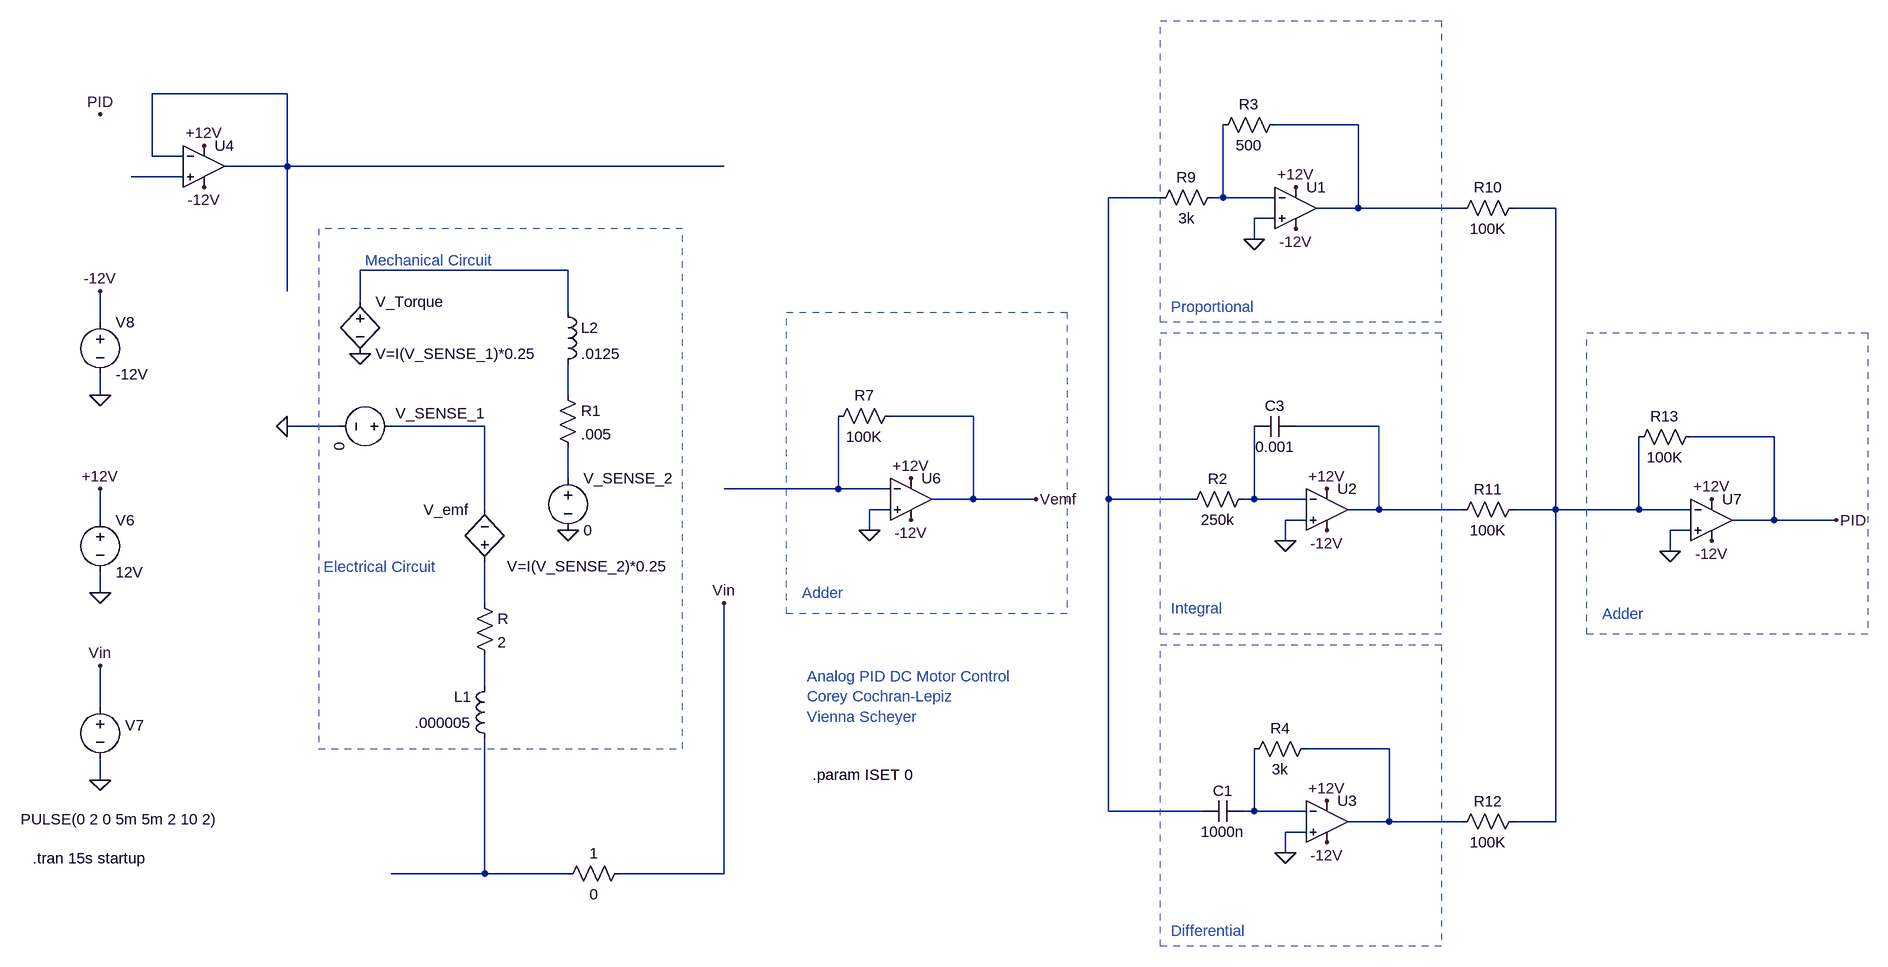
[diagram p0: schematic PID_parallel_opamps22.asc]
PID_parallel_opamps22.asc, the LTspice schematic file:
Version 4
SHEET 1 1388 1060
WIRE -1072 -272 -1280 -272
WIRE 576 -224 448 -224
WIRE -1280 -176 -1280 -272
WIRE -1232 -176 -1280 -176
WIRE -1072 -160 -1072 -272
WIRE -1072 -160 -1168 -160
WIRE -400 -160 -1072 -160
WIRE -1232 -144 -1312 -144
WIRE 272 -112 192 -112
WIRE 368 -112 368 -224
WIRE 368 -112 352 -112
WIRE 448 -112 368 -112
WIRE 576 -96 576 -224
WIRE 576 -96 512 -96
WIRE 736 -96 576 -96
WIRE 880 -96 816 -96
WIRE 448 -80 416 -80
WIRE 416 -48 416 -80
WIRE -640 0 -960 0
WIRE -1072 32 -1072 -160
WIRE -960 48 -960 0
WIRE -640 64 -640 0
WIRE -1360 80 -1360 32
WIRE -1360 192 -1360 160
WIRE -640 192 -640 144
WIRE -16 224 -144 224
WIRE -992 240 -1072 240
WIRE -768 240 -912 240
WIRE 608 240 480 240
WIRE 1216 256 1088 256
WIRE -640 320 -640 272
WIRE -224 336 -224 224
WIRE -224 336 -400 336
WIRE -144 336 -224 336
WIRE -16 352 -16 224
WIRE -16 352 -80 352
WIRE 80 352 -16 352
WIRE 192 352 192 -112
WIRE 320 352 192 352
WIRE 416 352 416 240
WIRE 416 352 400 352
WIRE 496 352 416 352
WIRE -768 368 -768 240
WIRE -144 368 -176 368
WIRE 608 368 608 240
WIRE 608 368 560 368
WIRE 736 368 608 368
WIRE 880 368 880 -96
WIRE 880 368 816 368
WIRE 1008 368 1008 256
WIRE 1008 368 880 368
WIRE 1088 368 1008 368
WIRE -1360 384 -1360 336
WIRE 496 384 464 384
WIRE 1216 384 1216 256
WIRE 1216 384 1152 384
WIRE 1312 384 1216 384
WIRE -176 400 -176 368
WIRE 1088 400 1056 400
WIRE 464 416 464 384
WIRE 1056 432 1056 400
WIRE -1360 496 -1360 464
WIRE -768 512 -768 448
WIRE -768 640 -768 592
WIRE -1360 672 -1360 608
WIRE 624 736 496 736
WIRE -1360 784 -1360 752
WIRE 192 832 192 352
WIRE 336 832 192 832
WIRE 416 832 416 736
WIRE 416 832 400 832
WIRE 496 832 416 832
WIRE 624 848 624 736
WIRE 624 848 560 848
WIRE 736 848 624 848
WIRE 880 848 880 368
WIRE 880 848 816 848
WIRE 496 864 464 864
WIRE 464 896 464 864
WIRE -768 928 -768 720
WIRE -768 928 -912 928
WIRE -640 928 -768 928
WIRE -400 928 -400 512
WIRE -400 928 -560 928
FLAG 416 -48 0
FLAG 464 416 0
FLAG 464 896 0
FLAG -1360 784 0
FLAG -1360 608 Vin
FLAG -1360 496 0
FLAG -1360 192 0
FLAG -1360 336 +12V
FLAG -1360 32 -12V
FLAG 480 -128 +12V
FLAG 528 336 +12V
FLAG 528 400 -12V
FLAG 480 -64 -12V
FLAG 528 880 -12V
FLAG 528 816 +12V
FLAG -1200 -192 +12V
FLAG -1200 -128 -12V
FLAG 80 352 Vemf
FLAG -640 400 0
FLAG -960 128 0
FLAG -176 400 0
FLAG -112 320 +12V
FLAG -112 384 -12V
FLAG 1056 432 0
FLAG 1120 352 +12V
FLAG 1120 416 -12V
FLAG 1312 384 PID
FLAG -1360 -240 PID
FLAG -400 512 Vin
FLAG -1072 240 0
SYMBOL Opamps\\UniversalOpamp2 480 -96 R0
SYMATTR InstName U1
SYMBOL Opamps\\UniversalOpamp2 528 368 R0
SYMATTR InstName U2
SYMBOL Opamps\\UniversalOpamp2 528 848 R0
SYMATTR InstName U3
SYMBOL res 416 336 R90
WINDOW 0 0 56 VBottom 2
WINDOW 3 32 56 VTop 2
SYMATTR InstName R2
SYMATTR Value 250k
SYMBOL res 464 -240 R90
WINDOW 0 0 56 VBottom 2
WINDOW 3 32 56 VTop 2
SYMATTR InstName R3
SYMATTR Value 500
SYMBOL cap 400 816 R90
WINDOW 0 0 32 VBottom 2
WINDOW 3 32 32 VTop 2
SYMATTR InstName C1
SYMATTR Value 1000n
SYMBOL cap 480 224 R90
WINDOW 0 0 32 VBottom 2
WINDOW 3 32 32 VTop 2
SYMATTR InstName C3
SYMATTR Value 0.001
SYMBOL res 512 720 R90
WINDOW 0 0 56 VBottom 2
WINDOW 3 32 56 VTop 2
SYMATTR InstName R4
SYMATTR Value 3k
SYMBOL voltage -1360 656 R0
WINDOW 0 39 44 Left 2
WINDOW 3 -122 188 Left 2
WINDOW 123 0 0 Left 0
WINDOW 39 0 0 Left 0
SYMATTR InstName V7
SYMATTR Value PULSE(0 2 0 5m 5m 2 10 2)
SYMBOL Opamps\\UniversalOpamp2 -1200 -160 R0
SYMATTR InstName U4
SYMBOL voltage -1360 368 R0
WINDOW 123 0 0 Left 0
WINDOW 39 0 0 Left 0
SYMATTR InstName V6
SYMATTR Value 12V
SYMBOL voltage -1360 64 R0
WINDOW 123 0 0 Left 0
WINDOW 39 0 0 Left 0
SYMATTR InstName V8
SYMATTR Value -12V
SYMBOL ind -752 736 R180
WINDOW 0 36 80 Left 2
WINDOW 3 36 40 Left 2
SYMATTR InstName L1
SYMATTR Value .000005
SYMBOL res -784 496 R0
SYMATTR InstName R
SYMATTR Value 2
SYMBOL bv -768 464 R180
WINDOW 0 24 96 Left 2
WINDOW 3 -280 9 Left 2
SYMATTR InstName V_emf
SYMATTR Value V=I(V_SENSE_2)*0.25
SYMBOL voltage -896 240 R90
WINDOW 123 0 0 Left 0
WINDOW 39 0 0 Left 0
WINDOW 0 -20 -127 VRight 2
SYMATTR InstName V_SENSE_1
SYMATTR Value 0
SYMBOL bv -960 32 R0
SYMATTR InstName V_Torque
SYMATTR Value V=I(V_SENSE_1)*0.25
SYMBOL ind -656 48 R0
SYMATTR InstName L2
SYMATTR Value .0125
SYMBOL res -656 176 R0
SYMATTR InstName R1
SYMATTR Value .005
SYMBOL voltage -640 304 R0
WINDOW 123 0 0 Left 0
WINDOW 39 0 0 Left 0
SYMATTR InstName V_SENSE_2
SYMATTR Value 0
SYMBOL Opamps\\UniversalOpamp2 -112 352 R0
SYMATTR InstName U6
SYMBOL res -128 208 R90
WINDOW 0 0 56 VBottom 2
WINDOW 3 32 56 VTop 2
SYMATTR InstName R7
SYMATTR Value 100K
SYMBOL res 368 -128 R90
WINDOW 0 0 56 VBottom 2
WINDOW 3 32 56 VTop 2
SYMATTR InstName R9
SYMATTR Value 3k
SYMBOL res 832 -112 R90
WINDOW 0 0 56 VBottom 2
WINDOW 3 32 56 VTop 2
SYMATTR InstName R10
SYMATTR Value 100K
SYMBOL res 832 352 R90
WINDOW 0 0 56 VBottom 2
WINDOW 3 32 56 VTop 2
SYMATTR InstName R11
SYMATTR Value 100K
SYMBOL res 832 832 R90
WINDOW 0 0 56 VBottom 2
WINDOW 3 32 56 VTop 2
SYMATTR InstName R12
SYMATTR Value 100K
SYMBOL Opamps\\UniversalOpamp2 1120 384 R0
SYMATTR InstName U7
SYMBOL res 1104 240 R90
WINDOW 0 0 56 VBottom 2
WINDOW 3 32 56 VTop 2
SYMATTR InstName R13
SYMATTR Value 100K
SYMBOL res -544 912 R90
WINDOW 0 0 56 VBottom 2
WINDOW 3 32 56 VTop 2
SYMATTR InstName 1
SYMATTR Value 0
TEXT -1464 904 Left 2 !.tran 15s startup
TEXT 288 56 Left 2 ;Proportional
TEXT 288 520 Left 2 ;Integral
TEXT 288 1016 Left 2 ;Differential
TEXT -280 496 Left 2 ;Adder
TEXT 952 528 Left 2 ;Adder
TEXT -952 -16 Left 2 ;Mechanical Circuit
TEXT -1016 456 Left 2 ;Electrical Circuit
TEXT -272 624 Left 2 ;Analog PID DC Motor Control\nCorey Cochran-Lepiz\nVienna Scheyer
TEXT -264 776 Left 2 !.param ISET 0
RECTANGLE Normal 704 80 272 -384 2
RECTANGLE Normal 704 1040 272 576 2
RECTANGLE Normal 704 560 272 96 2
RECTANGLE Normal 128 528 -304 64 2
RECTANGLE Normal 1360 560 928 96 2
RECTANGLE Normal -1024 736 -464 -64 2

The netlist it stands for:
* PID_parallel_opamps22.asc
XU1 0 N005 +12V -12V N002 level.2 Avol=1Meg GBW=10Meg Slew=10Meg ilimit=25m rail=0 Vos=0 phimargin=45 en=0 enk=0 in=0 ink=0 Rin=500Meg  ; pins IN+ IN- V+ V- OUT
XU2 0 N013 +12V -12V N010 level.2 Avol=1Meg GBW=10Meg Slew=10Meg ilimit=25m rail=0 Vos=0 phimargin=45 en=0 enk=0 in=0 ink=0 Rin=500Meg  ; pins IN+ IN- V+ V- OUT
XU3 0 N017 +12V -12V N016 level.2 Avol=1Meg GBW=10Meg Slew=10Meg ilimit=25m rail=0 Vos=0 phimargin=45 en=0 enk=0 in=0 ink=0 Rin=500Meg  ; pins IN+ IN- V+ V- OUT
R2 N013 N004 250k
R3 N002 N005 500
C1 N017 N004 1000n
C3 N010 N013 0.001
R4 N016 N017 3k
V7 Vin 0 PULSE(0 2 0 5m 5m 2 10 2)
XU4 N003 N001 +12V -12V N001 level.2 Avol=1Meg GBW=10Meg Slew=10Meg ilimit=25m rail=0 Vos=0 phimargin=45 en=0 enk=0 in=0 ink=0 Rin=500Meg  ; pins IN+ IN- V+ V- OUT
V6 +12V 0 12V
V8 -12V 0 -12V
L1 N018 N015 .000005
R N014 N015 2
B§V_emf N014 N009 V=I(V_SENSE_2)*0.25
V_SENSE_1 N009 0 0
B§V_Torque N007 0 V=I(V_SENSE_1)*0.25
L2 N007 N008 .0125
R1 N008 N011 .005
V_SENSE_2 N011 0 0
XU6 0 N012 +12V -12V Vemf level.2 Avol=1Meg GBW=10Meg Slew=10Meg ilimit=25m rail=0 Vos=0 phimargin=45 en=0 enk=0 in=0 ink=0 Rin=500Meg  ; pins IN+ IN- V+ V- OUT
R7 Vemf N012 100K
R9 N005 N004 3k
R10 N006 N002 100K
R11 N006 N010 100K
R12 N006 N016 100K
XU7 0 N006 +12V -12V PID level.2 Avol=1Meg GBW=10Meg Slew=10Meg ilimit=25m rail=0 Vos=0 phimargin=45 en=0 enk=0 in=0 ink=0 Rin=500Meg  ; pins IN+ IN- V+ V- OUT
R13 PID N006 100K
R§1 Vin N018 0
.tran 15s startup
* Proportional
* Integral
* Differential
* Adder
* Adder
* Mechanical Circuit
* Electrical Circuit
* Analog PID DC Motor Control
* Corey Cochran-Lepiz
* Vienna Scheyer
.param ISET 0
.lib UniversalOpamps2.sub
.backanno
.end